# Altium project Electrotecnai.PrjPcb
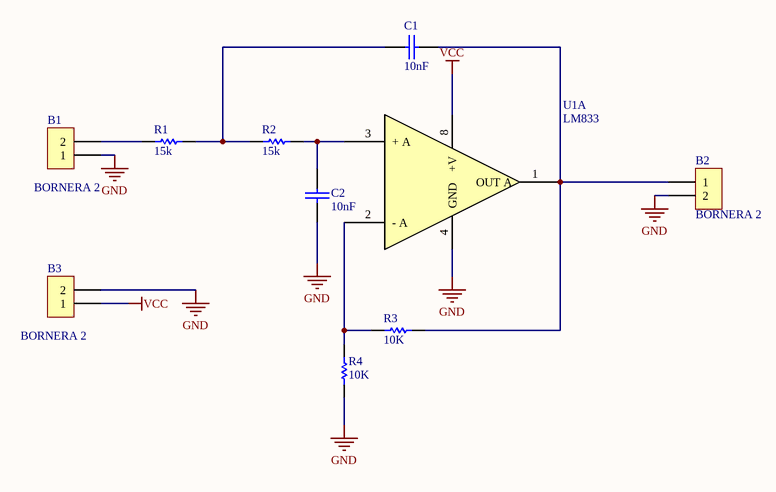
[diagram p0: Electro.SchDoc]
1 sheet, 10 parts. Net scope: global (net labels, ports and power ports of the same name join across sheets).
Board file: ElectroOpamps.PcbDoc

## Sheet Electro.SchDoc
size A

### Parts
B1  BORNERA 2  [BORNERA2]
B2  BORNERA 2  [BORNERA2]
B3  BORNERA 2  [BORNERA2]
C1  10nF  [CAP200]
C2  10nF  [CAP200]
R1  15k  [RES400]
R2  15k  [RES400]
R3  10K  [RES400]
R4  10K  [RES400]
U1  LM833  [DIP8]  (part A of 2)

### Nets
GND: B1.1 B2.2 B3.2 C2.1 R4.1 U1.4(GND)
VCC: B3.1 U1.8(+V)
NetB1_2: B1.2 R1.1
NetB2_1: B2.1 C1.2 R3.2 U1.1(OUT_A)
NetC1_1: C1.1 R1.2 R2.1
NetC2_2: C2.2 R2.2 U1.3(+_A)
NetR3_1: R3.1 R4.2 U1.2(-_A)

### Library data of the parts
C1 C2 = CAP
R1-R4 = RES
U1 = LM833: Dual Audio Operational Amplifier